# EAGLE board Data_memory (EAGLE 9.4.2), part 1 of 2
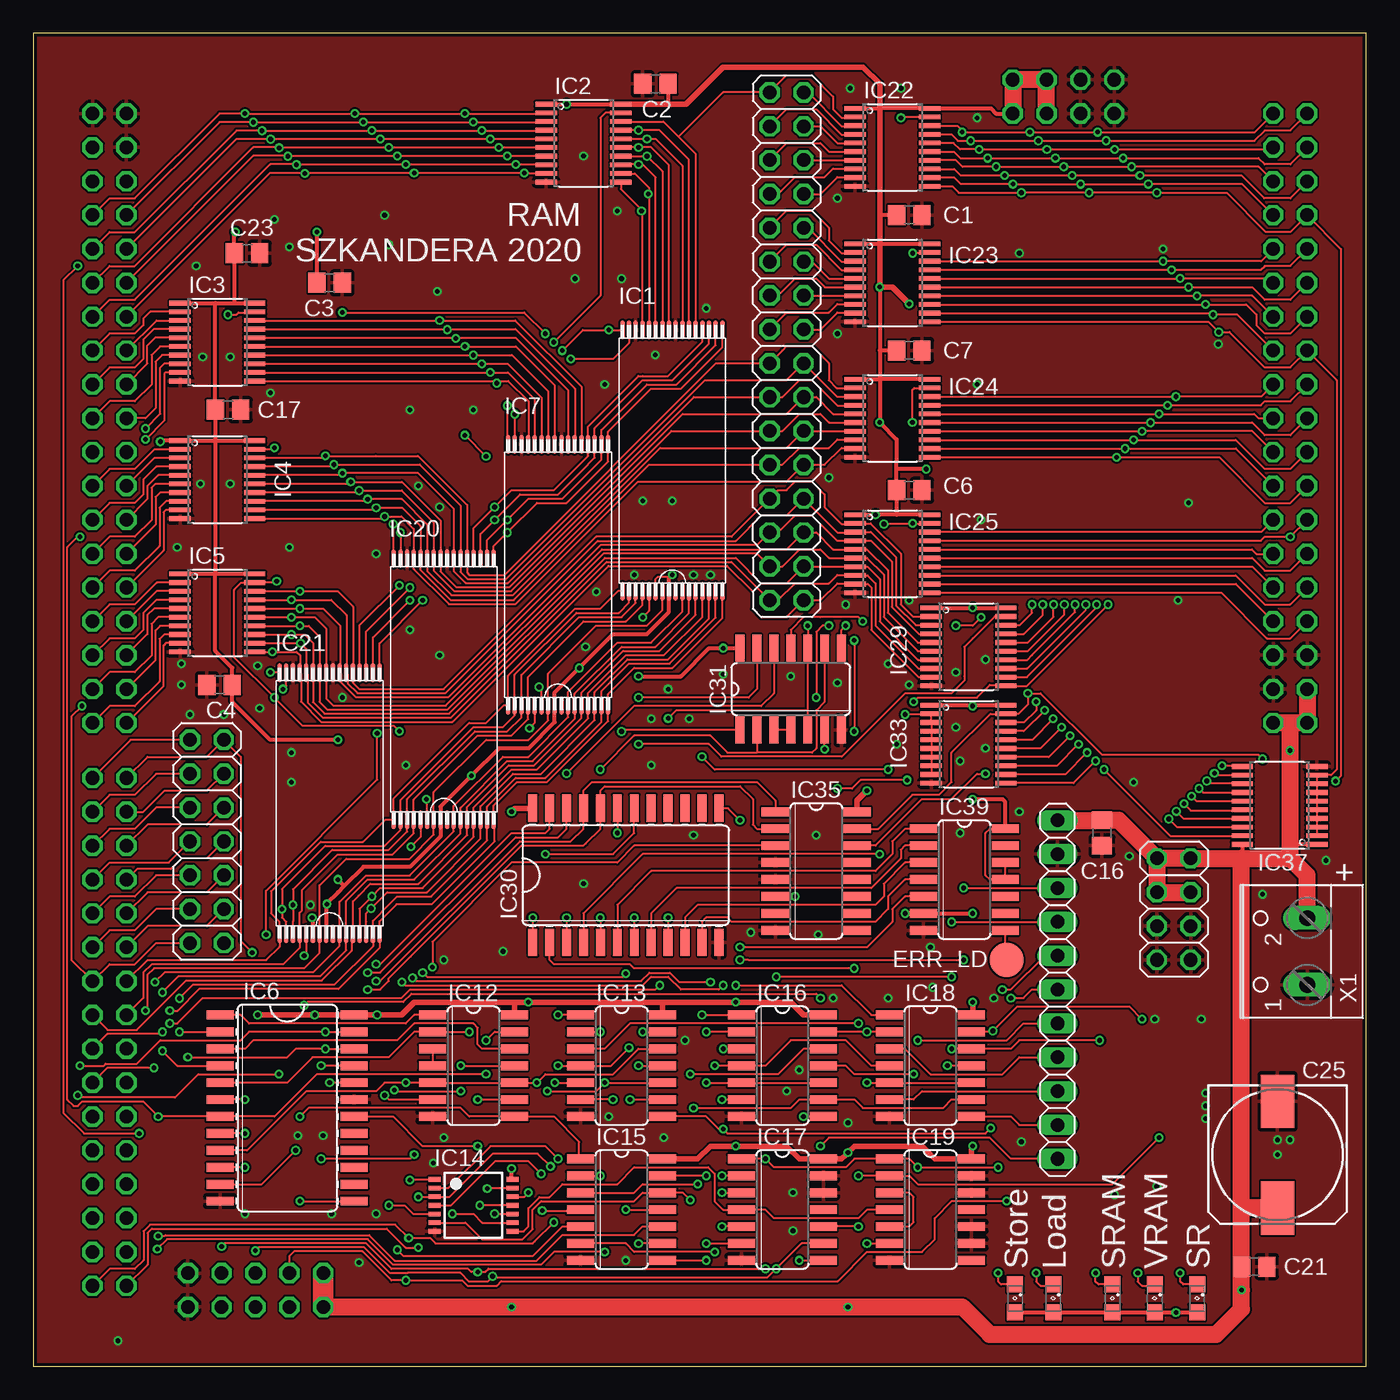
[diagram p2: board, top side]
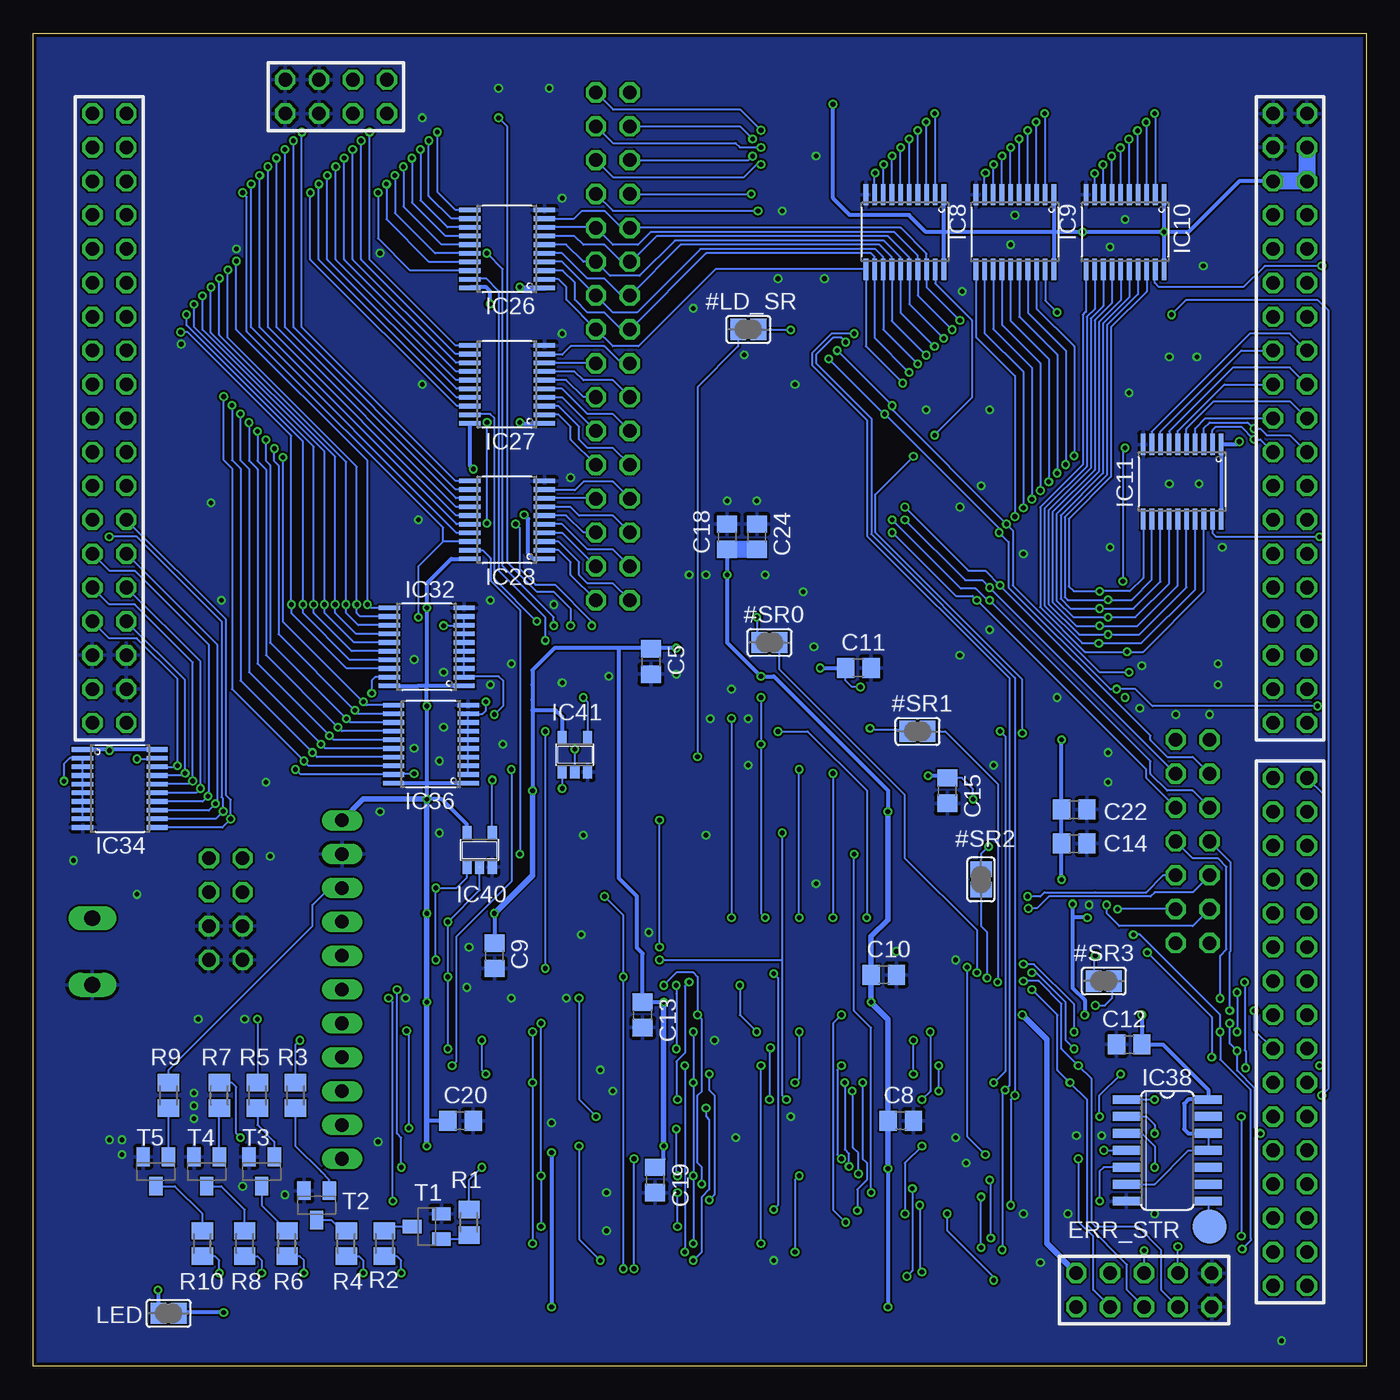
[diagram p3: board, bottom side, seen from below]

Size 100 x 100 mm. Coordinates in mm from the lower left corner, seen from the top.
Outline: 0,0 100,0 100,100 0,100 0,0
Copper layers (1*16): Top 0.035mm / dielectric 1.5mm / Bottom 0.035mm
Design rules "SeeedStudio_2layer_DRU_no_angle_20140221": minimum track width 6mil, minimum drill 12mil, track to track 6mil, track to pad 6mil, pad to pad 6mil, via to via 6mil, smd to smd 0mil, copper to edge 10mil, drill to drill 10mil, minimum pad ring 10mil, minimum via ring 6mil, stop-mask expansion 2mil, vias tented up to drill 100mil, thermal gap 10mil

## Footprints (pad centres in the part's own frame; a part is rotated, then mirrored left to right if it is on the bottom)
SJ = smd 1.168 x 1.6: 1 -0.762,0; 2 0.762,0
2X16 = drill 1.016 octagon: 1 -19.05,-1.27; 2 -19.05,1.27; 3 -16.51,-1.27; 4 -16.51,1.27; 5 -13.97,-1.27; 6 -13.97,1.27; 7 -11.43,-1.27; 8 -11.43,1.27; 9 -8.89,-1.27; 10 -8.89,1.27; 11 -6.35,-1.27; 12 -6.35,1.27; 13 -3.81,-1.27; 14 -3.81,1.27; 15 -1.27,-1.27; 16 -1.27,1.27; 17 1.27,-1.27; 18 1.27,1.27; 19 3.81,-1.27; 20 3.81,1.27; 21 6.35,-1.27; 22 6.35,1.27; 23 8.89,-1.27; 24 8.89,1.27; 25 11.43,-1.27; 26 11.43,1.27; 27 13.97,-1.27; 28 13.97,1.27; 29 16.51,-1.27; 30 16.51,1.27; 31 19.05,-1.27; 32 19.05,1.27
C0805 = smd 1.3 x 1.5: 1 -0.95,0; 2 0.95,0
153CLV-1010 = smd 4 x 2.5: + 4,0; - -4,0
B2,54 = smd 2.54 x 2.54: TP 0,0
TSOP-I-32-8X20MM = smd 1.4 x 0.33: 1 -9.8,3.75; 2 -9.8,3.25; 3 -9.8,2.75; 4 -9.8,2.25; 5 -9.8,1.75; 6 -9.8,1.25; 7 -9.8,0.75; 8 -9.8,0.25; 9 -9.8,-0.25; 10 -9.8,-0.75; 11 -9.8,-1.25; 12 -9.8,-1.75; 13 -9.8,-2.25; 14 -9.8,-2.75; 15 -9.8,-3.25; 16 -9.8,-3.75; 17 9.8,-3.75; 18 9.8,-3.25; 19 9.8,-2.75; 20 9.8,-2.25; 21 9.8,-1.75; 22 9.8,-1.25; 23 9.8,-0.75; 24 9.8,-0.25; 25 9.8,0.25; 26 9.8,0.75; 27 9.8,1.25; 28 9.8,1.75; 29 9.8,2.25; 30 9.8,2.75; 31 9.8,3.25; 32 9.8,3.75
TSSOP20 = smd 0.35 x 1.6: 1 -2.925,-2.8; 2 -2.275,-2.8; 3 -1.625,-2.8; 4 -0.975,-2.8; 5 -0.325,-2.8; 6 0.325,-2.8; 7 0.975,-2.8; 8 1.625,-2.8; 9 2.275,-2.8; 10 2.925,-2.8; 11 2.925,2.8; 12 2.275,2.8; 13 1.625,2.8; 14 0.975,2.8; 15 0.325,2.8; 16 -0.325,2.8; 17 -0.975,2.8; 18 -1.625,2.8; 19 -2.275,2.8; 20 -2.925,2.8
SO24W = smd 0.66 x 2.032: 1 -6.985,-5.029; 2 -5.715,-5.029; 3 -4.445,-5.029; 4 -3.175,-5.029; 5 -1.905,-5.029; 6 -0.635,-5.029; 7 0.635,-5.029; 8 1.905,-5.029; 9 3.175,-5.029; 10 4.445,-5.029; 11 5.715,-5.029; 12 6.985,-5.029; 13 6.985,5.029; 14 5.715,5.029; 15 4.445,5.029; 16 3.175,5.029; 17 1.905,5.029; 18 0.635,5.029; 19 -0.635,5.029; 20 -1.905,5.029; 21 -3.175,5.029; 22 -4.445,5.029; 23 -5.715,5.029; 24 -6.985,5.029
SO14 = smd 0.66 x 2.032: 1 -3.81,-3.073; 2 -2.54,-3.073; 3 -1.27,-3.073; 4 0,-3.073; 5 1.27,-3.073; 6 2.54,-3.073; 7 3.81,-3.073; 8 3.81,3.073; 9 2.54,3.073; 10 1.27,3.073; 11 0,3.073; 12 -1.27,3.073; 13 -2.54,3.073; 14 -3.81,3.073
TSSOP14 = smd 0.35 x 0.9: 1 -1.95,-2.925; 2 -1.3,-2.925; 3 -0.65,-2.925; 4 0,-2.925; 5 0.65,-2.925; 6 1.3,-2.925; 7 1.95,-2.925; 8 1.95,2.925; 9 1.3,2.925; 10 0.65,2.925; 11 0,2.925; 12 -0.65,2.925; 13 -1.3,2.925; 14 -1.95,2.925
SO16 = smd 0.66 x 2.032: 1 -4.445,-3.073; 2 -3.175,-3.073; 3 -1.905,-3.073; 4 -0.635,-3.073; 5 0.635,-3.073; 6 1.905,-3.073; 7 3.175,-3.073; 8 4.445,-3.073; 9 4.445,3.073; 10 3.175,3.073; 11 1.905,3.073; 12 0.635,3.073; 13 -0.635,3.073; 14 -1.905,3.073; 15 -3.175,3.073; 16 -4.445,3.073
SOT23-5 = smd 0.69 x 0.99: 1 -0.95,-1.29; 2 0,-1.29; 3 0.95,-1.29; 4 0.95,1.3; 5 -0.95,1.3
1X11 = drill 1.016 long: 1 -12.7,0; 2 -10.16,0; 3 -7.62,0; 4 -5.08,0; 5 -2.54,0; 6 0,0; 7 2.54,0; 8 5.08,0; 9 7.62,0; 10 10.16,0; 11 12.7,0
SML0805 = smd 1.2 x 1.2: A 1.05,0; C -1.05,0
2X04 = drill 1.016 octagon: 1 -3.81,-1.27; 2 -3.81,1.27; 3 -1.27,-1.27; 4 -1.27,1.27; 5 1.27,-1.27; 6 1.27,1.27; 7 3.81,-1.27; 8 3.81,1.27
M0805 = smd 1.3 x 1.6: 1 -0.95,0; 2 0.95,0
2X19 = drill 1.016 octagon: 1 -22.86,-1.27; 2 -22.86,1.27; 3 -20.32,-1.27; 4 -20.32,1.27; 5 -17.78,-1.27; 6 -17.78,1.27; 7 -15.24,-1.27; 8 -15.24,1.27; 9 -12.7,-1.27; 10 -12.7,1.27; 11 -10.16,-1.27; 12 -10.16,1.27; 13 -7.62,-1.27; 14 -7.62,1.27; 15 -5.08,-1.27; 16 -5.08,1.27; 17 -2.54,-1.27; 18 -2.54,1.27; 19 0,-1.27; 20 0,1.27; 21 2.54,-1.27; 22 2.54,1.27; 23 5.08,-1.27; 24 5.08,1.27; 25 7.62,-1.27; 26 7.62,1.27; 27 10.16,-1.27; 28 10.16,1.27; 29 12.7,-1.27; 30 12.7,1.27; 31 15.24,-1.27; 32 15.24,1.27; 33 17.78,-1.27; 34 17.78,1.27; 35 20.32,-1.27; 36 20.32,1.27; 37 22.86,-1.27; 38 22.86,1.27
2X07 = drill 1.016 octagon: 1 -7.62,-1.27; 2 -7.62,1.27; 3 -5.08,-1.27; 4 -5.08,1.27; 5 -2.54,-1.27; 6 -2.54,1.27; 7 0,-1.27; 8 0,1.27; 9 2.54,-1.27; 10 2.54,1.27; 11 5.08,-1.27; 12 5.08,1.27; 13 7.62,-1.27; 14 7.62,1.27
2X05 = drill 1.016 octagon: 1 -5.08,-1.27; 2 -5.08,1.27; 3 -2.54,-1.27; 4 -2.54,1.27; 5 0,-1.27; 6 0,1.27; 7 2.54,-1.27; 8 2.54,1.27; 9 5.08,-1.27; 10 5.08,1.27
SOT23-BEC = smd 1 x 1.4: B -0.95,-1.1; C 0,1.1; E 0.95,-1.1
W237-102 = drill 1.194 long: 1 -2.5,-1.27; 2 2.5,-1.27

## Placement (x,y rotation side)
#LD_SR  [SJ]  46.35,77.79 0 bottom
#SR0  [SJ]  44.77,54.29 0 bottom
#SR1  [SJ]  33.66,47.62 0 bottom
#SR2  [SJ]  28.89,36.51 90 bottom
#SR3  [SJ]  19.68,28.89 0 bottom
ALU_O_C0  [2X16]  5.71,25.08 270 top
C1  [C0805]  65.72,86.36 0 top
C2  [C0805]  46.67,96.2 180 top
C3  [C0805]  22.23,81.28 0 top
C4  [C0805]  13.97,51.12 180 top
C5  [C0805]  53.66,52.86 270 bottom
C6  [C0805]  65.72,65.72 0 top
C7  [C0805]  65.72,76.2 0 top
C8  [C0805]  34.92,18.41 0 bottom
C9  [C0805]  65.41,30.8 270 bottom
C10  [C0805]  36.2,29.37 0 bottom
C11  [C0805]  38.1,52.39 0 bottom
C12  [C0805]  17.78,24.13 180 bottom
C13  [C0805]  54.29,26.35 270 bottom
C14  [C0805]  21.91,39.21 0 bottom
C15  [C0805]  31.43,43.18 270 bottom
C16  [C0805]  80.17,40.01 270 top
C17  [C0805]  14.61,71.75 0 top
C18  [C0805]  47.94,62.23 90 bottom
C19  [C0805]  53.34,13.97 270 bottom
C20  [C0805]  67.94,18.41 0 bottom
C21  1u  [C0805]  91.6,7.46 0 top
C22  1u  [C0805]  21.91,41.75 0 bottom
C23  1u  [C0805]  16.03,83.5 0 top
C24  1u  [C0805]  45.72,62.23 90 bottom
C25  [153CLV-1010]  93.34,15.88 270 top
ERR_LD  PTR1B2,54  [B2,54]  73.03,30.48 0 top
ERR_STR  PTR1B2,54  [B2,54]  11.75,10.48 0 bottom
IC1  IS65C1024AL-45T  [TSOP-I-32-8X20MM]  47.94,67.94 90 top
IC2  74245  [TSSOP20]  41.27,91.76 270 top
IC3  74245  [TSSOP20]  13.81,76.83 270 top
IC4  74245  [TSSOP20]  13.81,66.52 270 top
IC5  74245  [TSSOP20]  13.81,56.52 270 top
IC6  74HCT154DW  [SO24W]  19.05,19.37 270 top
IC7  IS65C1024AL-45T  [TSOP-I-32-8X20MM]  39.37,59.37 90 top
IC8  74245  [TSSOP20]  34.61,85.09 180 bottom
IC9  74245  [TSSOP20]  26.35,85.09 180 bottom
IC10  74245  [TSSOP20]  18.1,85.09 180 bottom
IC11  74245  [TSSOP20]  13.81,66.36 180 bottom
IC12  74AC08D  [SO14]  33.02,22.54 270 top
IC13  74AC08D  [SO14]  44.13,22.54 270 top
IC14  7404  [TSSOP14]  33.02,12.06 270 top
IC15  74AC00D  [SO14]  44.13,11.75 270 top
IC16  74AC00D  [SO14]  56.2,22.54 270 top
IC17  74AC08D  [SO14]  56.2,11.75 270 top
IC18  74AC00D  [SO14]  67.31,22.54 270 top
IC19  74AC08D  [SO14]  67.31,11.75 270 top
IC20  IS65C1024AL-45T  [TSOP-I-32-8X20MM]  30.8,50.8 90 top
IC21  IS65C1024AL-45T  [TSOP-I-32-8X20MM]  22.23,42.23 90 top
IC22  74245  [TSSOP20]  64.45,91.44 270 top
IC23  74245  [TSSOP20]  64.45,81.28 270 top
IC24  74245  [TSSOP20]  64.45,71.12 270 top
IC25  74245  [TSSOP20]  64.45,60.96 270 top
IC26  74245  [TSSOP20]  64.45,83.82 90 bottom
IC27  74245  [TSSOP20]  64.45,73.66 90 bottom
IC28  74245  [TSSOP20]  64.45,63.5 90 bottom
IC29  74245  [TSSOP20]  70.17,53.98 270 top
IC30  74HCT154DW  [SO24W]  44.45,36.83 0 top
IC31  74AC08D  [SO14]  56.83,50.8 0 top
IC32  74245  [TSSOP20]  70.48,53.98 90 bottom
IC33  74245  [TSSOP20]  70.17,46.67 270 top
IC34  74245  [TSSOP20]  93.5,43.34 270 bottom
IC35  74AC138D  [SO16]  58.74,37.15 270 top
IC36  74245  [TSSOP20]  70.17,46.67 90 bottom
IC37  74245  [TSSOP20]  93.5,42.07 90 top
IC38  74AC30D  [SO14]  14.92,16.19 270 bottom
IC39  74AC30D  [SO14]  69.85,36.51 270 top
IC40  74HCT1G00  [SOT23-5]  66.52,38.73 0 bottom
IC41  74HCT1G08  [SOT23-5]  59.37,45.88 0 bottom
JP4  [1X11]  76.83,28.26 90 top
LED  [SJ]  89.85,3.97 0 bottom
LED1  [SML0805]  73.66,5.08 270 top
LED2  [SML0805]  80.96,5.08 270 top
LED3  [SML0805]  84.14,5.08 270 top
LED4  [SML0805]  87.31,5.08 270 top
LED8  [SML0805]  76.52,5.08 270 top
MB_C0  [2X16]  56.52,76.52 270 top
PWR  [2X04]  85.57,34.29 270 top
PWR1  [2X04]  77.29,95.25 0 top
R1  10k  [M0805]  67.31,10.79 270 bottom
R2  10k  [M0805]  73.66,9.21 270 bottom
R3  10k  [M0805]  80.33,20.32 270 bottom
R4  10k  [M0805]  76.52,9.21 270 bottom
R5  10k  [M0805]  83.19,20.32 270 bottom
R6  10k  [M0805]  80.96,9.21 270 bottom
R7  10k  [M0805]  86.04,20.32 270 bottom
R8  10k  [M0805]  84.14,9.21 270 bottom
R9  10k  [M0805]  89.85,20.32 270 bottom
R10  10k  [M0805]  87.31,9.21 270 bottom
RAM_O_C0  [2X19]  94.3,71.12 270 top
RB1_C0  [2X19]  5.71,71.12 270 top
RS2_C0  [2X07]  13.02,39.37 270 top
SIGNALS_C0  [2X05]  16.67,5.71 0 top
T1  [SOT23-BEC]  70.48,10.48 90 bottom
T2  [SOT23-BEC]  78.74,12.06 180 bottom
T3  [SOT23-BEC]  82.87,14.61 180 bottom
T4  [SOT23-BEC]  87,14.61 180 bottom
T5  [SOT23-BEC]  90.81,14.61 180 bottom
X1  [W237-102]  94.3,31.11 90 top

## Tracks (layer width: path | path; a pad name or v marks a point on that pad's centre or on a via)
#CLK
  Top 0.152: IC19.4 62.55,11.75 61.91,11.11 55.56,11.11 54.93,11.75 IC17.4 51.75,11.75 51.12,12.38 51.12,14.44 50.63,14.92 45.09,14.92 43.81,13.65 39.69,13.65 38.72,12.69 37.97,12.69 37.15,11.86 37.15,10.48 36.78,10.12 IC14.8
#LOAD  (via drill 0.35)
  Top 0.152: IC14.12 36.84,12.71 v37.15,13.02 | v38.42,38.42 43.5,38.42 45.09,40.01 IC30.18
  Bottom 0.152: v38.42,38.42 38.42,26.67 37.15,25.4 v37.15,13.02
#LOAD_SRAM  (via drill 0.35)
  Top 0.152: v39.69,76.2 41.23,77.75 v43.18,77.75 IC1.32 | v17.78,52.07 18.43,52.07 IC21.32 | IC18.11 v68.58,22.54 | v50.16,45.72 51.12,44.77 v64.14,44.77 | IC20.32 26.99,60.66 v26.99,63.18 | IC7.32 35.56,69.23 v35.56,72.07
  Bottom 0.152: v39.69,76.2 v35.56,72.07 35.56,71.75 v26.99,63.18 26.51,62.71 26.51,58.58 20,52.07 v17.78,52.07 | v68.58,22.54 68.26,22.86 68.26,32.23 64.14,36.35 v64.14,44.77 | v43.18,77.75 43.22,77.79 #LD_SR.2 #LD_SR.1 47.12,76.52 50.16,73.47 v50.16,45.72
#STORE_R0  (via drill 0.35)
  Top 0.152: IC1.5 46.19,56.67 v45.72,56.2 | v29.21,29.53 29.53,29.21 44.21,29.21 v44.45,29.45 | v44.45,11.75 IC15.11
  Bottom 0.152: v29.21,29.53 29.18,29.55 29.18,32.68 34.61,38.1 34.61,42.86 44.01,52.26 #SR0.2 #SR0.1 45.69,54.45 45.69,56.17 v45.72,56.2 | v44.45,29.45 44.13,29.13 44.13,12.06 v44.45,11.75
#STORE_R1  (via drill 0.35)
  Top 0.152: IC7.5 37.62,48.26 v37.22,47.87 | v27.64,28.81 27.88,28.57 45.72,28.57 46.35,29.21 47.62,29.21 48.58,28.26 51.44,28.26 v51.75,28.57 | v51.75,23.81 IC16.3
  Bottom 0.152: v27.64,28.81 27.62,28.83 27.62,43.66 31.58,47.62 #SR1.2 #SR1.1 34.58,47.78 37.14,47.78 v37.22,47.87 | v51.75,28.57 51.75,27.94 v51.75,23.81
#STORE_R2  (via drill 0.35)
  Top 0.152: IC20.5 29.05,39.69 v28.33,38.98 | v28.45,29.13 28.69,28.89 45.61,28.89 46.23,29.52 47.75,29.52 48.45,28.81 v50.8,28.81 | v51.67,20 IC16.6
  Bottom 0.152: v50.8,28.81 51.12,28.5 51.12,23.5 51.75,22.86 51.75,20.08 v51.67,20 | v28.33,38.98 28.89,38.42 #SR2.2 #SR2.1 28.89,33.02 28.45,32.58 v28.45,29.13
#STORE_R3  (via drill 0.35)
  Top 0.152: IC21.5 20.48,30.95 v20.32,30.8 | v20.32,27.07 20.57,27.32 27.75,27.32 28.37,27.94 58.74,27.94 v59.05,27.62 | v57.78,18.73 IC16.8
  Bottom 0.152: v59.05,27.62 59.05,20 v57.78,18.73 | v20.32,30.8 20.45,30.67 #SR3.1 19.05,28.89 | 19.05,28.89 #SR3.2 | v20.32,27.07 19.61,27.07 19.05,27.62 19.05,28.89
#STORE_VR0  (via drill 0.35)
  Top 0.152: v66.04,21.91 61.59,21.91 60.96,22.54 IC16.11 | JP4.5 74.3,25.72 73.03,24.45 v66.36,24.45
  Bottom 0.152: v66.36,24.45 66.36,22.23 v66.04,21.91
#STORE_VR1
  Top 0.152: IC18.3 65.41,23.81 67.31,21.91 72.71,21.91 73.98,23.18 JP4.4
#STORE_VR2
  Top 0.152: IC18.6 66.04,20 66.67,20.64 JP4.3
#STORE_VR3
  Top 0.152: IC18.8 73.34,18.73 73.98,18.1 JP4.2
#STR  (via drill 0.35)
  Top 0.152: IC6.18 26.99,18.73 29.21,16.51 v33.34,16.51 | v34.61,11.43 35.93,11.43 IC14.10
  Bottom 0.152: v33.34,16.51 34.61,15.24 v34.61,11.43
#Y30  (via drill 0.35)
  Top 0.152: IC14.2 31.14,13.37 34.29,16.51 38.42,16.51 v39.37,15.56 | v39.37,22.54 IC13.4 43.35,22.54 v44.69,23.89 | v44.77,20 IC13.9
  Bottom 0.152: v39.37,15.56 39.69,15.88 39.69,22.23 v39.37,22.54 | v44.69,23.89 44.77,23.81 v44.77,20
#Y31  (via drill 0.35)
  Top 0.152: IC13.2 v42.55,25.08 | IC13.10 v42.86,21.27 42.23,20.64 v38.56,20.64 | IC14.4 31.34,12.06 34.66,15.38 37.15,15.38 v38.1,14.43
  Bottom 0.152: v42.55,25.08 42.55,21.59 v42.86,21.27 | v38.1,14.43 38.1,15.99 38.49,16.38 38.49,20.57 v38.56,20.64
_G8  (via drill 0.35)
  Top 0.152: v59.37,46.29 IC31.6
  Bottom 0.152: IC41.2 v59.37,46.29
ALU_O_0  (via drill 0.35)
  Top 0.152: IC6.23 v21.91,25.08 16.19,25.08 15.56,24.45 9.53,24.45 7.77,22.69 5.43,22.69 5.28,22.54 v3.49,22.54 | v25.72,30.16 26.04,30.16 35.88,40.01 38.42,40.01 38.73,40.32 IC30.23 | ALU_O_C0.1 7.3,46.99 RS2_C0.1
  Bottom 0.152: v21.91,25.08 21.91,27.15 24.92,30.16 v25.72,30.16 | ALU_O_C0.1 3.16,42.85 3.16,22.87 v3.49,22.54
ALU_O_1  (via drill 0.35)
  Top 0.152: IC6.22 v21.91,23.81 19.68,23.81 19.05,23.18 v11.59,23.18 | v25.08,29.53 26.04,29.53 36.2,39.69 39.37,39.69 40.01,40.32 IC30.22 | ALU_O_C0.2 8.57,45.72 13.02,45.72 RS2_C0.2 15.56,45.72 15.56,31.9 v16.42,31.04
  Bottom 0.152: v21.91,23.81 22.54,24.45 22.54,27.3 24.77,29.53 v25.08,29.53 | v16.42,31.04 11.59,26.2 v11.59,23.18
ALU_O_2  (via drill 0.35)
  Top 0.152: IC1.20 50.19,76.86 47.62,74.3 45.72,74.3 45.4,74.3 41.62,70.51 IC7.20 41.62,68.29 39.05,65.72 35.88,65.72 v34.61,64.45 33.05,62.89 IC20.20 | v27.46,58.58 24.48,55.59 IC21.20 | ALU_O_C0.3 5.71,42.86 7.62,42.86 9.21,44.45 RS2_C0.3
  Bottom 0.152: v34.61,64.45 29.84,59.69 28.57,59.69 v27.46,58.58 16.19,47.31 16.19,46.99 14.92,45.72 13.02,45.72 RS2_C0.3
ALU_O_3  (via drill 0.35)
  Top 0.152: IC1.19 50.69,76.73 47.94,73.98 45.72,73.98 42.12,70.38 IC7.19 42.12,68.16 41.12,67.15 39.37,65.41 36.51,65.41 v34.61,63.5 33.55,62.44 IC20.19 | IC21.19 24.98,55.14 v28.26,58.42 | RS2_C0.4 13.02,43.18 9.84,43.18 8.26,41.59 ALU_O_C0.4
  Bottom 0.152: v34.61,63.5 30.07,58.96 28.8,58.96 v28.26,58.42 RS2_C0.4
ALU_O_4  (via drill 0.35)
  Top 0.152: IC1.18 51.19,76.59 48.26,73.66 46.04,73.66 42.62,70.24 IC7.18 42.62,68.02 39.69,65.09 37.15,65.09 v35.56,63.5 34.05,61.99 IC20.18 | IC21.18 25.48,54.69 v28.26,57.47 | ALU_O_C0.5 5.71,40.32 7.62,40.32 9.21,41.91 RS2_C0.5
  Bottom 0.152: v35.56,63.5 30.4,58.34 29.3,58.34 28.42,57.47 v28.26,57.47 16.19,45.4 16.19,44.45 14.92,43.18 13.02,43.18 RS2_C0.5
ALU_O_5  (via drill 0.35)
  Top 0.152: IC7.17 43.12,69.22 | 43.12,69.22 43.12,70.11 46.35,73.34 48.58,73.34 51.69,76.46 IC1.17 | IC20.17 34.55,60.64 34.55,61.53 v35.56,62.55 37.78,64.77 40.01,64.77 43.12,67.89 43.12,69.22 | IC21.17 25.98,54.23 v29.21,57.47 | RS2_C0.6 13.02,40.64 8.57,40.64 ALU_O_C0.6
  Bottom 0.152: v35.56,62.55 30.8,57.78 29.53,57.78 v29.21,57.47 16.51,44.77 16.51,44.13 RS2_C0.6
ALU_O_6  (via drill 0.35)
  Top 0.152: IC1.16 51.69,56.14 47.94,52.39 45.09,52.39 43.12,50.42 IC7.16 43.12,48.4 38.53,43.81 36.31,43.81 34.55,42.05 IC20.16 34.61,40.94 34.61,39.37 29.89,34.65 27.25,34.65 25.98,33.38 IC21.16 25.98,31.37 22.9,28.3 12.44,28.3 10.82,26.67 v10.24,26.67 | ALU_O_C0.7 5.71,37.78 10.16,37.78 RS2_C0.7
  Bottom 0.152: v10.24,26.67 10.24,31.08 10.17,31.15 10.17,37.8 RS2_C0.7
ALU_O_7  (via drill 0.35)
  Top 0.152: IC1.15 51.19,56.16 47.74,52.7 44.68,52.7 42.62,50.65 IC7.15 42.62,48.34 38.42,44.13 36.2,44.13 34.05,41.98 IC20.15 34.05,39.45 29.84,35.24 27.3,35.24 26.67,34.61 25.48,33.41 IC21.15 25.48,31.51 22.58,28.61 11.97,28.61 v10.95,27.59 | RS2_C0.8 13.02,38.1 11.11,38.1 10.32,37.31 7.78,37.31 ALU_O_C0.8
  Bottom 0.152: v10.95,27.59 10.95,30.8 10.48,31.27 10.48,37.47 11.11,38.1 13.02,38.1 RS2_C0.8
ALU_O_8  (via drill 0.35)
  Top 0.152: IC21.14 24.98,33.34 24.98,33.98 v25.34,34.35 25.5,34.51 26.56,35.56 29.53,35.56 33.55,39.58 IC20.14 33.55,42.01 35.99,44.45 38.1,44.45 42.12,48.47 IC7.14 42.12,50.58 44.56,53.02 47.62,53.02 50.69,56.09 IC1.14 | ALU_O_C0.9 5.71,35.24 7.62,35.24 9.21,36.83 RS2_C0.9
  Bottom 0.152: RS2_C0.9 13.02,35.56 15.88,35.56 16.19,35.24 23.81,35.24 24.61,34.45 24.71,34.35 v25.34,34.35
ALU_O_9  (via drill 0.35)
  Top 0.152: IC21.13 24.48,34.32 v25.4,35.24 26.04,35.88 29.21,35.88 33.05,39.72 IC20.13 33.05,41.94 35.88,44.77 37.78,44.77 41.62,48.6 IC7.13 41.62,50.51 44.45,53.34 47.31,53.34 50.19,56.23 IC1.13 | RS2_C0.10 13.02,35.56 8.57,35.56 ALU_O_C0.10
  Bottom 0.152: RS2_C0.10 15.24,36.83 16.51,35.56 20.32,35.56 24.13,35.56 24.45,35.24 v25.4,35.24
ALU_O_10  (via drill 0.35)
  Top 0.152: IC21.3 19.48,33.38 v19.48,34.61 19.48,35.78 22.43,38.73 26.67,38.73 28.05,40.11 IC20.3 28.05,42.54 33.13,47.62 35.56,47.62 36.62,48.69 IC7.3 36.62,51.86 40.96,56.2 44.13,56.2 45.19,57.26 IC1.3 | ALU_O_C0.11 5.71,32.7 7.62,32.7 9.21,34.29 RS2_C0.11
  Bottom 0.152: RS2_C0.11 13.02,33.02 18.52,33.02 19.48,33.97 v19.48,34.61
ALU_O_11  (via drill 0.35)
  Top 0.152: IC21.2 18.98,33.34 18.66,33.66 v18.66,34.29 18.66,35.8 21.89,39.04 26.34,39.04 27.55,40.25 IC20.2 27.55,42.47 33.02,47.94 35.24,47.94 36.12,48.82 IC7.2 36.12,51.88 40.75,56.52 43.93,56.52 44.69,57.28 IC1.2 | RS2_C0.12 13.02,33.02 8.57,33.02 ALU_O_C0.12
  Bottom 0.152: RS2_C0.12 v18.66,34.29
ALU_O_12  (via drill 0.35)
  Top 0.152: IC1.31 44.69,76.76 43.5,75.56 v40.32,75.56 | v36.12,71.44 IC7.31 | v18.73,50.8 18.98,51.04 IC21.31 | v27.54,62.55 v27.55,62.54 IC20.31 | v3.65,49.53 2.86,48.74 2.86,30.48 ALU_O_C0.13 5.71,30.16 7.62,30.16 9.21,31.75 RS2_C0.13
  Bottom 0.152: v40.32,75.56 36.2,71.44 v36.12,71.44 27.54,62.87 v27.54,62.55 26.83,61.83 26.83,58.42 19.21,50.8 v18.73,50.8 17.3,50.8 16.03,49.53 v3.65,49.53
ALU_O_13
  Top 0.152: IC1.1 43.86,58.15 42.55,56.83 40.64,56.83 35.62,51.81 IC7.1 35.28,49.57 33.97,48.26 32.7,48.26 27.05,42.6 IC20.1 26.39,41 24.74,39.34 21.57,39.34 17.84,35.62 17.84,33.97 18.48,33.34 IC21.1 18.48,31.48 17.48,30.48 8.57,30.48 ALU_O_C0.14
ALU_O_14
  Top 0.152: IC1.12 49.69,56.36 46.99,53.66 44.25,53.66 41.12,50.53 IC7.12 41.12,48.63 37.58,45.09 35.67,45.09 32.55,41.96 IC20.12 32.55,39.85 28.89,36.2 25.29,36.2 24.39,35.3 23.98,34.88 IC21.12 23.87,32.32 23.87,31.16 21.65,28.94 11.48,28.94 7.77,25.23 5.57,25.23 ALU_O_C0.15
ALU_O_15
  Top 0.152: IC1.4 45.69,57.12 44.45,55.88 41.27,55.88 37.12,51.73 IC7.4 37.12,48.55 35.88,47.31 33.34,47.31 28.55,42.52 IC20.4 28.55,39.98 26.95,38.38 22.82,38.38 20.13,35.69 20.13,34.17 19.98,34.02 IC21.4 20,32.4 20,31.43 18.73,30.16 8.89,30.16 8.26,29.53 8.26,27.62 ALU_O_C0.16
ALU_O_16  (via drill 0.35)
  Top 0.152: IC1.11 49.19,56.49 46.67,53.98 44.13,53.98 40.62,50.46 IC7.11 40.64,49.55 40.64,48.58 37.47,45.4 35.56,45.4 32.05,41.89 IC20.11 32.05,39.98 28.57,36.51 25.08,36.51 23.48,34.91 IC21.11 23.48,31.2 21.52,29.25 10.89,29.25 v9.68,28.04 | v9.68,25.08 9.53,24.92 5.56,24.92 ALU_O_C0.17
  Bottom 0.152: v9.68,28.04 v9.68,25.08
ALU_O_17  (via drill 0.35)
  Top 0.152: IC1.7 47.19,56.72 46.04,55.56 42.23,55.56 38.62,51.95 IC7.7 38.62,48.46 37.15,46.99 33.97,46.99 30.05,43.06 IC20.7 30.05,39.89 28.23,38.08 23.47,38.08 21.48,36.08 IC21.7 21.48,31 20.33,29.86 9.06,29.86 8.56,29.36 8.56,26.82 v8.41,26.67
  Bottom 0.152: v8.41,26.67 8.41,25.24 ALU_O_C0.18
ALU_O_18  (via drill 0.35)
  Top 0.152: IC1.10 48.69,56.63 46.35,54.29 43.81,54.29 40.12,50.6 IC7.10 40.12,48.69 37.15,45.72 35.24,45.72 31.55,42.02 IC20.10 31.55,40.12 28.25,36.82 24.96,36.82 22.98,34.84 IC21.10 22.98,31.52 21.01,29.55 9.86,29.55 v9.12,28.81 | v9.05,22.38 5.56,22.38 ALU_O_C0.19
  Bottom 0.152: v9.12,28.81 9.12,23.73 9.05,23.65 v9.05,22.38
ALU_O_30  (via drill 0.35)
  Top 0.152: v28.26,13.97 28.3,14.02 IC14.1 | IC13.1 v39.37,26.35 | v39.05,10.79 37.62,9.37 | 37.62,9.37 37.47,9.21 | 37.47,9.21 30.16,9.21 29.75,9.62 v28.16,9.62 27.16,10.62 8.76,10.62 8.27,10.13 8.27,7.95 7.62,7.3 5.71,7.3 ALU_O_C0.31 | 37.47,9.21 37.62,9.37
  Bottom 0.152: v28.16,9.62 28.16,13.88 v28.26,13.97 | v39.37,26.35 40.01,25.72 40.01,11.75 v39.05,10.79
ALU_O_31  (via drill 0.35)
  Top 0.152: v28.89,12.7 28.91,12.71 IC14.3 31.24,12.71 34.47,15.94 37.85,15.94 v38.8,14.99 | v39.13,21.27 IC13.5 | ALU_O_C0.32 8.57,7.62 8.57,10 8.89,10.32 26.51,10.32 27.94,8.89 v28.89,8.89
  Bottom 0.152: v28.89,8.89 v28.89,12.7 | v38.8,14.99 38.8,15.94 39.12,16.26 39.12,21.26 v39.13,21.27
B  (via drill 0.35)
  Top 0.152: v92.23,45.56 91.92,45.88 80.17,45.88 75.56,50.48 v74.61,50.48 74.61,49.64 73.92,48.95 IC33.19 71.81,48.95 68.9,46.04 68.9,43.81 67.94,42.86 65.94,42.86 63.4,40.32 IC35.15
  Bottom 0.152: IC32.19 74.35,51.7 74.61,51.44 v74.61,50.48 | v92.23,45.56 90.76,45.56 IC34.19
B0
  Top 0.152: IC12.1 28.57,26.35 27.94,25.72 16.19,25.72 15.56,26.35 IC6.1
B1  (via drill 0.35)
  Top 0.152: v32.38,69.85 v33.97,68.26 | IC15.2 v42.55,14.29 | v9.3,8.79 10.03,9.53 25.08,9.53 26.99,7.62 38.1,7.62 39.05,8.57 v42.86,8.57 | v10.95,25.08 IC6.2 | v17.46,32.38 17.46,35.67 25.8,44.01 v25.8,47.49
  Bottom 0.152: IC8.19 32.33,81.23 29.58,78.48 29.58,72.65 v32.38,69.85 | v33.97,68.26 36.83,65.41 36.83,62.55 25.8,51.51 v25.8,47.49 | v42.55,14.29 42.86,13.97 v42.86,8.57 | v9.3,8.79 8.67,9.43 8.67,9.59 8.67,20.73 10.95,23.02 v10.95,25.08 10.95,26.35 16.99,32.38 v17.46,32.38
B2
  Top 0.152: IC12.12 33.66,23.81 33.34,24.13 33.34,25.4 33.02,25.72 28.57,25.72 27.3,24.45 16.51,24.45 15.88,23.81 IC6.3
B3  (via drill 0.35)
  Top 0.152: v46.99,28.57 46.67,28.26 28.26,28.26 27.62,27.62 12.7,27.62 10.79,25.72 v10.24,25.72 | v45.72,25.08 IC13.13 | v3.33,82.55 2.25,81.46 2.25,19.02 3.81,17.46 v7.94,17.46 | v9.68,23.65 10.79,22.54 IC6.4
  Bottom 0.152: IC10.19 15.88,82.24 15.88,81.28 15.56,80.96 9.21,80.96 7.62,82.55 v3.33,82.55 | v46.99,28.57 46.99,26.35 v45.72,25.08 | v7.94,17.46 8.36,17.89 8.36,20.86 9.68,22.18 v9.68,23.65 10.24,24.21 v10.24,25.72
BO0  (via drill 0.35)
  Top 0.152: IC31.1 44.23,47.73 v44.13,47.62 | v37.47,33.66 IC30.1
  Bottom 0.152: v44.13,47.62 41.91,47.62 37.47,43.18 v37.47,33.66
BO1  (via drill 0.35)
  Top 0.152: v61.59,29.84 48.26,29.84 45.09,29.84 44.77,30.16 39.05,30.16 38.73,30.48 IC30.2 | v61.59,54.45 v61.59,47.62
  Bottom 0.152: IC26.19 67.18,81.62 66.04,81.62 65.09,80.66 65.09,59.69 62.87,57.47 61.59,56.2 v61.59,54.45 | v61.59,47.62 v61.59,29.84
BO2  (via drill 0.35)
  Top 0.152: IC31.12 55.56,50.48 54.61,49.53 45.06,49.53 v40.01,44.47 | v40.01,33.66 IC30.3
  Bottom 0.152: v40.01,44.47 v40.01,33.66
BO3  (via drill 0.35)
  Top 0.152: v63.5,38.42 45.72,38.42 41.27,33.97 IC30.4
  Bottom 0.152: IC28.19 66.31,61.23 65.71,60.63 65.71,58.93 63.5,56.72 v63.5,38.42
CLK  (via drill 0.35)
  Top 0.152: v31.43,11.43 33.02,11.43 33.69,10.77 IC14.9 | v73.03,12.38 68.9,12.38 67.63,11.11 67.63,9.53 66.67,8.57 62.55,8.57 60.35,6.38 35.11,6.38 34.78,6.04 32.58,6.04 32.18,6.44 v27.94,6.44 26.87,6.44 24.7,8.61 19.56,8.61 19.21,8.26 SIGNALS_C0.8 | v73.34,27.62 74.3,27.62 74.93,28.26 JP4.6
  Bottom 0.152: v31.43,11.43 31.43,10.16 27.94,6.67 v27.94,6.44 | v73.03,12.38 73.03,27.3 v73.34,27.62
ERR_UN_LOAD
  Top 0.152: ERR_LD.TP 72.92,30.58 IC39.8
ERR_UN_STR
  Bottom 0.152: ERR_STR.TP 11.85,10.58 IC38.8
G1  (via drill 0.35)
  Top 0.152: IC2.19 42.91,94.03 42.55,93.66 42.55,80.33 v39.05,76.83 | v26.35,20.32 26.67,20 IC12.6 | v26.67,12.06 27.86,12.06 28.51,11.41 IC14.5
  Bottom 0.152: v39.05,76.83 39.37,77.15 40.01,77.15 41.27,75.88 41.27,75.25 40.32,74.3 37.13,71.11 37.13,62.42 26.35,51.64 v26.35,20.32 26.67,20 v26.67,12.06
G2  (via drill 0.35)
  Top 0.152: IC3.19 16.56,79.06 15.4,79.06 15.24,78.9 v14.61,78.9 | v20,18.73 20.64,19.37 32.07,19.37 32.7,18.73 IC12.8 39.05,18.73 40.96,16.83 40.96,15.66 IC15.1 | v3.33,20.32 3.49,20.16 10.64,20.16 12.38,21.91 v18.41,21.91
  Bottom 0.152: v20,18.73 20,20.32 v18.41,21.91 | v14.61,78.9 13.49,80.01 3.65,80.01 2.86,79.22 2.86,20.8 v3.33,20.32
G5  (via drill 0.35)
  Top 0.152: v38.42,77.47 36.83,79.06 v23.18,79.06 | v27.1,20.72 27.1,20.64 v32.07,20.64 | v32.07,22.54 IC12.11 | v27.3,8.73 27.78,8.26 37.47,8.26 39.69,10.48 IC15.5
  Bottom 0.152: IC9.19 24.08,79.96 v23.18,79.06 | v38.42,77.47 40.12,77.47 41.58,76.01 41.58,75.12 37.44,70.98 37.44,62.3 26.78,51.63 26.78,21.03 v27.1,20.72 27.3,20.51 v27.3,8.73 | v32.07,20.64 v32.07,22.54
G8  (via drill 0.35)
  Top 0.152: IC22.19 65.14,93.72 v65.09,93.66 | v59.69,55.56 59.21,55.56 58.74,55.09 v58.74,50.16
  Bottom 0.152: v59.69,55.56 59.69,56.83 60.96,58.1 62.23,58.1 64.45,60.33 64.45,93.03 v65.09,93.66 | v58.74,50.16 58.42,49.85 IC41.4
G9  (via drill 0.35)
  Top 0.152: v60.96,55.56 60.64,55.24 IC31.8 | v65.97,83.5 66.03,83.56 IC23.19
  Bottom 0.152: v65.97,83.5 64.78,82.31 64.78,60.02 60.96,56.2 v60.96,55.56
G10  (via drill 0.35)
  Top 0.152: v62.23,55.88 61.91,56.2 59.05,56.2 57.78,56.2 56.83,55.24 IC31.11
  Bottom 0.152: v62.23,55.88 65.41,59.05 65.41,71.12 65.72,71.44 67.2,71.44 IC27.19
GND  (via drill 0.35)
  other vias: 11.11,52.7 28.26,55.24 30.48,53.34 28.26,71.75 33.02,71.75 19.21,83.98 26.67,84.14 26.35,86.36 18.1,86.04 41.27,90.81 43.81,86.68 44.13,81.6 40.64,81.6 46.67,75.88 42.86,73.66 50.48,79.38 60.33,77.47 59.69,66.67 86.68,64.77 88.9,76.68 84.77,83.82 70.8,93.66 85.88,57.47 82.55,43.81 64.14,52.7 64.77,46.67 56.83,51.75 47.62,50.8 49.21,48.58 46.35,48.58 46.35,45.09 41.27,36.2 30.8,30.48 53.82,32.54 67.31,31.43 87.63,26.04 72.07,27.62 64.14,27.62 60.01,27.62 56.52,20.64 57.47,22.23 48.9,24.45 47.31,17.14 25.72,11.43 24.45,7.78 44.45,7.94 30.8,17.14 6.35,1.91 19.84,17.3 20.8,34.61 27.94,45.09 41.43,53.98 45.09,59.37 42.23,58.1 60.96,57.15 65.72,57.47 84.14,26.04 30.48,64.45 23.18,50.16 19.37,46.04 19.37,43.81 60.33,87.63 61.28,95.89 65.09,95.89 69.22,47.94 71.44,53.02 71.44,46.35 69.22,52.07 65.72,51.12 69.53,45.4 70.8,73.66 71.12,63.5 73.98,83.5 28.89,66.04 82.23,38.26 73.98,41.59 69.53,40.01 50.8,59.37 49.53,59.37 58.9,32.38 58.74,39.85 19.21,61.44 10.79,61.44 12.54,66.2 14.76,66.2 17.78,73.03 14.76,75.72 12.7,75.72 12.22,82.55 21.75,17.3 22.38,11.43 15.88,11.43 30,15.24 43.18,18.73 56.99,10.16 56.99,13.02 61.12,18.26 35.24,31.11 49.53,39.85 67.47,28.42 74.14,16.83 81.12,12.86 84.3,13.49 51.75,51.91 45.72,64.93 47.94,64.93 25.72,60.96 30.32,80.64 92.23,35.4 97,37.94 60.33,51.28 16.83,52.55 11.11,51.12 11.75,48.9 14.29,48.9 16.99,49.37 87.95,20.48 87.95,19.53 87.95,18.57 93.34,15.88 93.34,16.99 94.3,16.99
  pour Bottom: -7.3,107.31 105.57,107.31 105.57,57.63 105.57,-6.83 21.11,-6.83 -7.3,-6.83
  pour Top: -10,109.22 107.16,109.22 107.16,38.73 107.16,-8.57 16.99,-8.57 -10,-8.57
H  (via drill 0.35)
  Top 0.152: IC37.19 85.3,39.79 v80.33,44.77 | v71.44,44.45 70.8,44.45 68.9,42.55 66.67,42.55 63.18,39.05 IC35.14
  Bottom 0.152: v80.33,44.77 79.96,44.4 IC36.19 72.92,44.45 v71.44,44.45
H0  (via drill 0.35)
  Top 0.152: v32.7,25.08 IC12.2 28.57,25.08 26.67,23.18 20.95,23.18 19.05,21.27 IC6.5 | v33.34,20 IC12.9
  Bottom 0.152: v32.7,25.08 32.7,20.64 v33.34,20
H1  (via drill 0.35)
  Top 0.152: v15.88,20 IC6.6
  Bottom 0.152: IC38.1 v15.88,20
H2  (via drill 0.35)
  Top 0.152: v33.97,24.45 34.61,25.08 IC12.13 | v33.97,21.91 21.27,21.91 18.1,18.73 IC6.7 v9.37,18.73 8.24,19.86 3.66,19.86 3.33,19.53 3.02,19.53 2.55,19.99 2.55,61.45 3.33,62.23 v3.49,62.23 | v9.37,9.76 9.84,9.76 9.9,9.83 25.21,9.83 27.11,7.92 37.77,7.92 39.69,9.84 45.09,9.84 45.72,10.48 IC15.10
  Bottom 0.152: v33.97,21.91 v33.97,24.45 | IC11.19 11.54,62.49 11.27,62.23 v3.49,62.23 | v9.37,18.73 v9.37,9.76
H3  (via drill 0.35)
  Top 0.152: v15.88,17.46 IC6.8
  Bottom 0.152: IC38.2 16.51,18.73 15.88,18.1 v15.88,17.46
HO0  (via drill 0.35)
  Top 0.152: IC31.9 59.37,49.85 58.74,49.21 58.74,46.35 58.42,46.04 54.29,46.04 | IC31.2 54.29,46.04 | 54.29,46.04 52.07,46.04 50.8,47.31 45.09,47.31 v42.55,44.77 | v42.55,33.66 IC30.5
  Bottom 0.152: v42.55,33.66 v42.55,44.77
HO1
  Top 0.152: IC39.1 65.41,40.32 64.45,39.37 64.45,38.42 63.18,37.15 46.35,37.15 43.81,34.61 IC30.6
HO2  (via drill 0.35)
  Top 0.152: IC31.13 54.29,50.8 53.66,50.16 v45.4,50.16 | v45.09,33.66 IC30.7 | IC29.19 72.12,56.25 70.48,54.61 69.85,53.98 69.85,51.75 69.85,51.44 68.9,50.48 65.41,50.48 60.66,45.73 51.63,45.73 50.69,46.67 v45.4,46.67
  Bottom 0.152: v45.4,50.16 v45.4,46.67 45.4,33.97 v45.09,33.66
HO3
  Top 0.152: IC39.2 65.41,39.05 65.09,38.73 65.09,38.1 62.87,35.88 48.26,35.88 46.35,33.97 IC30.8
INS_F3_0  (via drill 0.35)
  Top 0.152: IC6.21 v21.59,22.54 | v25.72,28.89 26.04,28.89 36.51,39.37 40.32,39.37 41.27,40.32 IC30.21 41.27,43.18 41.91,43.81 54.29,43.81 55.66,42.44 IC35.1
  Bottom 0.152: v25.72,28.89 24.56,28.89 22.86,27.19 22.86,23.81 v21.59,22.54 20.64,21.59 20.64,10.79 20.32,10.48 17.14,10.48 15.4,8.73 15.4,5.71 SIGNALS_C0.3
INS_F3_1  (via drill 0.35)
  Top 0.152: IC6.20 v22.23,21.27 | v25.08,28.26 26.04,28.26 26.67,28.89 26.67,29.1 28.31,30.74 36.63,39.05 41.27,39.05 41.43,39.21 42.55,40.32 IC30.20 42.55,43.18 42.86,43.5 53.02,43.5 53.98,42.55 53.98,40.64 54.29,40.32 IC35.2
  Bottom 0.152: v25.08,28.26 23.16,26.34 23.16,22.21 v22.23,21.27 20.95,20 20.95,10.64 17.94,7.62 17.94,5.71 SIGNALS_C0.5
INS_F3_2  (via drill 0.35)
  Top 0.152: IC35.3 45.09,39.05 43.81,37.78 35.88,37.78 29.94,31.84 v29.94,29.94 | v28.57,15.88 28.26,15.56 v21.59,15.56
  Bottom 0.152: v29.94,29.94 29.94,17.24 v28.57,15.88 | SIGNALS_C0.7 20.48,5.71 20.48,9.73 21.58,10.83 21.58,15.54 v21.59,15.56
LOAD_VRAM  (via drill 0.35)
  Top 0.152: v59.05,16.51 59.69,17.14 71.75,17.14 73.34,15.56 JP4.1 | v57.47,7.94 IC17.8
  Bottom 0.152: v59.05,16.51 59.05,9.53 v57.47,7.94
MB0
  Top 0.152: IC2.18 47.27,93.38 48.42,92.23 | IC1.21 49.69,90.96 48.42,92.23 | 48.42,92.23 51.75,95.57 MB_C0.1 56.52,96.84 58.42,96.84 60.01,95.25 60.01,94.3 60.64,93.66 61.6,93.66 IC22.2
MB1  (via drill 0.35)
  Top 0.152: IC1.22 49.19,90.51 46.97,92.73 v45.4,92.73 IC2.17 | MB_C0.2 58.1,95.57 60.64,93.03 61.62,93.03 IC22.3
  Bottom 0.152: MB_C0.2 56.52,94.3 46.97,94.3 v45.4,92.73
MB2  (via drill 0.35)
  Top 0.152: IC2.16 v46.04,92.08 46.66,92.08 48.69,90.06 IC1.23 | MB_C0.3 56.52,94.3 58.74,94.3 60.64,92.39 61.63,92.39 IC22.4
  Bottom 0.152: MB_C0.3 46.98,93.03 v46.04,92.08
MB3  (via drill 0.35)
  Top 0.152: IC1.25 47.69,90.1 46.35,91.44 v45.4,91.44 44.08,91.44 IC2.15 | MB_C0.4 59.05,93.03 60.33,91.76 61.65,91.76 IC22.5
  Bottom 0.152: MB_C0.4 56.52,91.76 47.31,91.76 46.99,91.44 v45.4,91.44
MB4  (via drill 0.35)
  Top 0.152: IC2.14 v46.04,90.78 46.06,90.78 47.19,89.65 IC1.26 | MB_C0.5 56.52,91.76 59.05,91.76 59.7,91.11 IC22.6
  Bottom 0.152: MB_C0.5 46.33,90.49 v46.04,90.78
MB5  (via drill 0.35)
  Top 0.152: IC1.27 46.69,89.2 45.72,90.17 v45.4,90.17 44.11,90.17 IC2.13 | MB_C0.6 61.63,90.49 IC22.7
  Bottom 0.152: MB_C0.6 56.52,89.22 46.67,89.22 45.72,90.17 v45.4,90.17
MB6  (via drill 0.35)
  Top 0.152: IC2.12 45.14,89.48 46.19,88.43 46.19,87.95 | 46.19,87.95 IC1.28 | v46.14,87.95 46.19,87.95 | MB_C0.7 55.88,87.95 57.15,89.22 59.37,89.22 60.01,89.85 61.62,89.85 IC22.8
  Bottom 0.152: MB_C0.7 v46.14,87.95
MB7  (via drill 0.35)
  Top 0.152: IC1.29 45.69,86.68 | 45.69,86.68 45.69,86.7 44.08,88.32 IC2.11 | v45.64,86.68 45.69,86.68 | MB_C0.8 59.05,87.95 60.33,89.22 61.6,89.22 IC22.9
  Bottom 0.152: MB_C0.8 56.52,86.68 v45.64,86.68
MB8  (via drill 0.35)
  Top 0.152: IC7.21 41.12,73.5 36.16,78.46 v30.48,78.46 IC3.18 | MB_C0.9 56.52,86.68 58.42,86.68 59.69,85.41 59.69,84.45 60.64,83.5 61.6,83.5 IC23.2
  Bottom 0.152: v30.48,78.46 32.98,80.96 IC8.18 32.98,83.47 34.92,85.41 MB_C0.9 55.88,85.41 57.15,86.68 58.85,86.68 59.43,86.09 IC26.9
MB9  (via drill 0.35)
  Top 0.152: IC3.17 31.11,77.81 | 31.11,77.81 36.17,77.81 40.64,73.34 40.64,69.19 IC7.22 | v31.07,77.77 | v31.07,77.77 31.11,77.81 | MB_C0.10 58.1,85.41 60.64,82.87 61.62,82.87 IC23.3
  Bottom 0.152: v31.07,77.77 33.63,80.33 IC8.17 33.63,83.32 35.4,85.09 53.68,85.09 54.63,84.14 56.52,84.14 MB_C0.10 57.82,85.44 IC26.8
MB10  (via drill 0.35)
  Top 0.152: IC3.16 31.43,77.16 | 31.43,77.16 36.19,77.16 40.12,73.23 IC7.23 | v31.71,77.12 31.48,77.12 31.43,77.16 | MB_C0.11 56.52,84.14 58.74,84.14 60.64,82.23 61.63,82.23 IC23.4
  Bottom 0.152: v31.71,77.12 34.28,79.69 IC8.16 34.28,83.18 35.88,84.77 53.25,84.77 55.16,82.87 MB_C0.11 55.88,82.87 57.15,84.14 58.74,84.14 59.4,84.8 IC26.7
MB11  (via drill 0.35)
  Top 0.152: IC3.15 v32.38,76.51 | v32.38,76.51 36.2,76.51 39.12,73.59 IC7.25 | v32.38,76.51 | MB_C0.12 58.42,82.87 59.69,81.6 61.65,81.6 IC23.5
  Bottom 0.152: v32.38,76.51 34.93,79.06 IC8.15 34.93,83.19 36.2,84.45 51.87,84.45 54.51,81.81 56.73,81.81 MB_C0.12 58.74,82.87 60.02,84.14 IC26.6
MB12  (via drill 0.35)
  Top 0.152: IC3.14 v33.02,75.86 | v33.02,75.86 35.9,75.86 38.62,73.14 IC7.26 | v33.02,75.86 | MB_C0.13 55.88,80.33 57.15,81.6 58.74,81.6 59.38,80.95 IC23.6
  Bottom 0.152: v33.02,75.86 35.58,78.42 IC8.14 35.58,83.21 36.51,84.14 51.44,84.14 MB_C0.13 55.88,80.33 57.15,81.6 58.42,81.6 60.33,83.5 61.65,83.5 IC26.5
MB13  (via drill 0.35)
  Top 0.152: IC3.13 v33.66,75.21 | v33.66,75.21 35.6,75.21 38.12,72.69 IC7.27 | v33.66,75.21 | MB_C0.14 61.63,80.33 IC23.7
  Bottom 0.152: v33.66,75.21 36.23,77.79 IC8.13 36.23,83.22 36.83,83.82 49.96,83.82 54.72,79.06 56.52,79.06 MB_C0.14 60.33,82.87 61.63,82.87 IC26.4
MB14  (via drill 0.35)
  Top 0.152: IC3.12 v34.29,74.56 | v34.29,74.56 35.61,74.56 37.62,72.55 IC7.28 | v34.29,74.56 | MB_C0.15 56.52,79.06 59.69,79.06 60.33,79.69 61.62,79.69 IC23.8
  Bottom 0.152: v34.29,74.56 36.88,77.15 IC8.12 36.88,83.24 37.15,83.5 49.53,83.5 MB_C0.15 55.88,77.79 57.15,79.06 58.42,79.06 59.37,80.01 59.37,81.28 60.29,82.19 IC26.3
MB15  (via drill 0.35)
  Top 0.152: IC3.11 34.61,73.91 | 34.61,73.91 35.63,73.91 37.15,72.39 37.15,69.2 IC7.29 | v34.77,73.75 34.61,73.91 | MB_C0.16 59.05,77.79 60.33,79.06 61.6,79.06 IC23.9
  Bottom 0.152: v34.77,73.75 37.53,76.52 IC8.11 48.84,82.29 54.61,76.52 56.52,76.52 MB_C0.16 60.01,80.01 60.01,80.96 60.59,81.55 IC26.2
MB16  (via drill 0.35)
  Top 0.152: IC4.18 21.75,68.14 v21.91,68.3 25.72,68.3 28.86,68.3 32.55,64.61 IC20.21 32.55,59.53 32.7,59.37 35.36,59.37 51.23,75.25 MB_C0.17 56.2,76.2 56.52,76.52 58.42,76.52 59.69,75.25 59.69,73.98 60.27,73.39 IC24.2
  Bottom 0.152: IC9.18 24.73,79.34 21.91,76.52 v21.91,68.3 | MB_C0.17 55.88,75.25 57.15,76.52 59.69,76.52 60.33,75.88 61.6,75.88 IC27.9
MB17  (via drill 0.35)
  Top 0.152: IC4.17 22.38,67.49 v22.54,67.65 28.98,67.65 32.05,64.59 IC20.22 32.05,59.6 32.58,59.07 35.48,59.07 50.39,73.98 56.52,73.98 MB_C0.18 60.29,72.75 IC24.3
  Bottom 0.152: IC9.17 25.38,79.03 22.54,76.2 v22.54,67.65 | MB_C0.18 61.62,75.25 IC27.8
MB18  (via drill 0.35)
  Top 0.152: IC4.16 23.02,66.84 v23.18,67 28.89,67 31.55,64.34 IC20.23 31.55,59.66 32.45,58.76 35.61,58.76 49.55,72.71 MB_C0.19 56.2,72.71 57.47,73.98 58.42,73.98 60.33,72.07 61.63,72.07 IC24.4
  Bottom 0.152: IC9.16 26.03,78.73 23.18,75.88 v23.18,67 | MB_C0.19 56.52,73.98 58.74,73.98 59.4,74.64 IC27.7
MB19  (via drill 0.35)
  Top 0.152: IC4.15 23.65,66.19 v23.81,66.35 27.66,66.35 30.55,63.46 IC20.25 30.55,59.62 31.71,58.46 35.73,58.46 48.71,71.44 56.52,71.44 MB_C0.20 58.74,72.71 60.01,71.44 61.65,71.44 IC24.5
  Bottom 0.152: IC9.15 26.68,78.43 23.81,75.56 v23.81,66.35 | MB_C0.20 58.74,72.71 60.02,73.98 IC27.6
MB20  (via drill 0.35)
  Top 0.152: v24.45,65.7 24.29,65.54 IC4.14 | v24.45,65.7 27.64,65.7 30.05,63.3 IC20.26 30.05,59.69 31.59,58.15 35.86,58.15 47.88,70.17 MB_C0.21 56.2,70.17 57.47,71.44 59.05,71.44 59.7,70.8 IC24.6 | v24.45,65.7
  Bottom 0.152: IC9.14 27.33,78.13 24.45,75.25 v24.45,65.7 | MB_C0.21 56.52,71.44 58.42,71.44 60.33,73.34 61.65,73.34 IC27.5
MB21  (via drill 0.35)
  Top 0.152: IC4.13 24.93,64.89 v25.08,65.05 27.66,65.05 29.55,63.16 IC20.27 29.55,59.67 31.37,57.85 35.99,57.85 47.04,68.9 56.52,68.9 MB_C0.22 61.63,70.17 IC24.7
  Bottom 0.152: IC9.13 27.98,77.83 25.08,74.93 v25.08,65.05 | MB_C0.22 60.3,72.69 IC27.4
MB22  (via drill 0.35)
  Top 0.152: IC4.12 25.56,64.24 v25.72,64.4 27.68,64.4 29.05,63.03 IC20.28 29.05,59.74 31.32,57.47 36.04,57.47 46.2,67.63 MB_C0.23 56.2,67.63 57.47,68.9 59.69,68.9 60.33,69.53 61.62,69.53 IC24.8
  Bottom 0.152: IC9.12 28.63,77.52 25.72,74.61 v25.72,64.4 | MB_C0.23 56.52,68.9 58.42,68.9 59.05,69.53 59.05,70.48 60.6,72.03 IC27.3
MB23  (via drill 0.35)
  Top 0.152: IC24.9 61.6,68.9 60.64,68.9 59.37,67.63 MB_C0.24 56.52,66.36 45.36,66.36 36.16,57.16 31.19,57.16 28.55,59.81 IC20.29 28.55,62.83 27.62,63.75 v26.35,63.75 26.2,63.59 IC4.11
  Bottom 0.152: IC9.11 29.28,77.22 26.35,74.3 v26.35,63.75 | MB_C0.24 59.69,69.53 59.69,70.48 60.59,71.39 IC27.2
MB24  (via drill 0.35)
  Top 0.152: IC29.2 65.99,56.25 65.09,57.15 65.09,60.96 62.81,63.23 IC25.2 61.6,63.18 60.64,63.18 59.37,64.45 59.37,65.41 58.42,66.36 57.15,66.36 56.52,65.72 55.88,65.72 MB_C0.25 52.39,62.23 42.23,62.23 30.8,50.8 24.45,50.8 23.98,51.27 IC21.21 23.98,56.99 22.82,58.14 v20,58.14 IC5.18
  Bottom 0.152: MB_C0.25 56.52,66.36 58.74,66.36 59.37,65.72 61.6,65.72 IC28.9 | IC10.18 16.47,80.64 19.14,77.97 19.14,66.74 22.31,63.57 22.31,58.51 21.95,58.14 v20,58.14 17.74,58.14 16.74,59.15 IC11.11
MB25  (via drill 0.35)
  Top 0.152: IC29.3 66.21,55.6 64.72,57.09 64.72,60.69 62.83,62.59 IC25.3 61.62,62.55 60.33,62.55 MB_C0.26 56.52,63.82 54.61,63.82 52.7,61.91 42.34,61.91 30.92,50.49 24.32,50.49 23.58,51.23 23.58,51.92 IC21.22 23.5,52.05 23.5,56.36 22.36,57.49 v19.37,57.49 IC5.17
  Bottom 0.152: MB_C0.26 57.82,65.12 IC28.8 | IC10.17 17.12,80.42 19.44,78.1 19.44,66.87 22.62,63.7 22.62,57.7 22.38,57.47 19.39,57.47 v19.37,57.49 17.6,57.49 16.09,59 IC11.12
MB26  (via drill 0.35)
  Top 0.152: IC29.4 66.42,54.95 64.41,56.96 64.41,60.36 62.84,61.94 IC25.4 60.3,61.94 58.42,63.82 57.15,63.82 55.88,62.55 MB_C0.27 54.29,61.59 42.55,61.59 31.14,50.19 24.2,50.19 23.08,51.3 23.08,51.92 IC21.23 23.02,52.07 23.02,55.56 21.74,56.84 v20,56.84 IC5.16
  Bottom 0.152: MB_C0.27 56.52,63.82 59.05,63.82 59.71,64.47 IC28.7 | IC10.16 17.77,80.2 19.75,78.22 19.75,67 22.92,63.82 22.92,57.58 22.19,56.84 v20,56.84 17.45,56.84 15.44,58.86 IC11.13
MB27  (via drill 0.35)
  Top 0.152: IC29.5 66.36,54.29 64.11,56.54 64.11,59.72 62.54,61.28 IC25.5 61.65,61.28 60.01,61.28 58.74,62.55 MB_C0.28 56.52,61.28 42.66,61.28 30.95,49.57 22.5,49.57 21.98,50.1 IC21.25 21.98,55.34 21.12,56.19 v19.37,56.19 IC5.15
  Bottom 0.152: MB_C0.28 58.74,62.55 60.02,63.83 IC28.6 | IC10.15 18.42,79.98 20.05,78.35 20.05,67.12 23.23,63.95 23.23,57.45 21.97,56.19 v19.37,56.19 17.31,56.19 14.79,58.72 IC11.14
MB28  (via drill 0.35)
  Top 0.152: IC29.6 66.36,53.65 63.8,56.21 63.8,59.38 62.55,60.63 IC25.6 59.7,60.63 59.05,61.28 57.47,61.28 56.2,60.01 MB_C0.29 54.29,60.96 42.77,60.96 31.07,49.26 22.06,49.26 21.48,49.85 IC21.26 21.48,54.73 20.66,55.54 v20,55.54 IC5.14
  Bottom 0.152: MB_C0.29 56.52,61.28 58.42,61.28 60.32,63.17 IC28.5 | IC10.14 19.07,79.76 20.36,78.47 20.36,67.25 23.53,64.07 23.53,57.33 21.75,55.54 v20,55.54 17.17,55.54 14.14,58.57 IC11.15
MB29  (via drill 0.35)
  Top 0.152: IC29.7 66.38,53 63.5,55.88 63.5,59.05 62.57,59.98 IC25.7 61.63,60.01 MB_C0.30 56.52,58.74 54.61,58.74 52.7,60.64 42.89,60.64 31.2,48.96 21.84,48.96 20.98,49.83 IC21.27 20.98,54.27 20.36,54.89 v19.37,54.89 IC5.13
  Bottom 0.152: MB_C0.30 60.3,62.52 IC28.4 | IC10.13 19.72,79.54 20.66,78.6 20.66,67.38 23.84,64.2 23.84,57.2 21.53,54.89 v19.37,54.89 17.02,54.89 13.49,58.43 IC11.16
MB30  (via drill 0.35)
  Top 0.152: IC29.8 66.39,52.35 63.18,55.56 63.18,58.74 62.59,59.34 IC25.8 61.62,59.37 60.33,59.37 59.69,58.74 57.15,58.74 55.88,57.47 MB_C0.31 52.38,60.34 43.01,60.34 31.33,48.65 21.72,48.65 20.58,49.79 20.58,51.92 IC21.28 20.48,53.82 v20.05,54.24 IC5.12
  Bottom 0.152: MB_C0.31 56.52,58.74 58.42,58.74 59.05,59.37 59.05,60.33 60.6,61.88 IC28.3 | IC10.12 20.37,79.32 20.97,78.73 20.97,67.5 24.14,64.33 24.14,57.07 21.31,54.24 v20.05,54.24 16.88,54.24 12.84,58.28 IC11.17
MB31  (via drill 0.35)
  Top 0.152: IC29.9 66.41,51.7 62.87,55.24 62.87,58.42 62.6,58.69 IC25.9 61.6,58.74 60.33,58.74 59.05,57.47 MB_C0.32 56.52,56.2 54.61,56.2 53.98,56.83 53.98,58.1 52.05,60.03 43.14,60.03 31.45,48.35 21.59,48.35 20.08,49.86 20.08,51.92 IC21.29 20,52.05 20,53.34 19.75,53.59 v17.94,53.59 IC5.11
  Bottom 0.152: MB_C0.32 59.69,59.37 59.69,60.33 60.59,61.23 IC28.2 | IC10.11 21.02,79.11 21.27,78.86 21.27,67.63 24.45,64.45 24.45,56.95 21.09,53.59 v17.94,53.59 16.74,53.59 12.19,58.14 IC11.18
MEM_LOAD  (via drill 0.35)
  Top 0.152: v57.15,35.24 IC35.6 | IC14.13 35.91,13.34 v34.05,13.34 | IC17.9 57.64,9.21 v55.73,7.3 55.71,7.3 55.09,6.68 34.53,6.68 v34.46,6.75 34.07,6.35 32.7,6.35 32.05,7 28.1,7 26.75,7 24.83,8.91 16.92,8.91 v16.67,8.66 | v68.9,23.81 69.85,23.81 IC18.12 73.34,23.81 73.98,24.45 v80.01,24.45 | v68.9,29.21 v55.73,29.21 | v68.9,33.34 JP4.8
  Bottom 0.152: v55.73,7.3 v55.73,29.21 55.73,33.83 v57.15,35.24 | v34.05,13.34 34.05,7.16 v34.46,6.75 | v68.9,23.81 v68.9,29.21 v68.9,33.34 66.52,35.72 IC40.2 | R3.1 80.33,24.13 v80.01,24.45 | v16.67,8.66 SIGNALS_C0.6
MEM_STORE  (via drill 0.35)
  Top 0.152: IC17.1 v54.93,15.56 55.56,14.92 60.96,14.92 61.59,15.56 IC19.1 65.72,15.56 v66.36,14.92 v72.39,14.92 | IC14.11 v33.49,12.06 | v72.71,28.26 73.34,28.26 75.88,30.8 JP4.7 | v14.13,8.97 14.38,9.22 21.11,9.22 24.96,9.22 26.87,7.3 32.62,7.3 32.86,7.06 v33.34,7.06 33.89,7.06 34.14,7.32 54.91,7.32 v54.93,7.3
  Bottom 0.152: v54.93,7.3 v54.93,15.56 | v33.49,12.06 33.49,7.22 v33.34,7.06 | R1.1 67.31,13.97 v66.36,14.92 | v72.39,14.92 72.39,17.14 72.71,17.46 v72.71,28.26 | SIGNALS_C0.4 v14.13,8.97
N$1
  Top 0.152: IC12.3 IC12.4
N$2  (via drill 0.35)
  Top 0.152: IC15.9 v45.4,9.21 | v45.4,22.54 IC13.11
  Bottom 0.152: v45.4,9.21 v45.4,22.54
N$3  (via drill 0.35)
  Top 0.152: IC17.5 v51.67,10.48 | v51.67,13.02 IC17.3
  Bottom 0.152: v51.67,10.48 v51.67,13.02
N$4  (via drill 0.35)
  Top 0.152: IC18.10 IC18.5 v62.55,21.27 | IC18.2 v62.55,25.08 IC16.13 | v62.55,9.21 IC19.6
  Bottom 0.152: v62.55,25.08 v62.55,21.27 v62.55,9.21
N$5
  Top 0.152: IC19.5 65.72,10.48 66.04,10.79 66.04,12.7 65.72,13.02 IC19.3
N$6
  Top 0.152: IC31.4 IC31.3
N$7  (via drill 0.35)
  Top 0.152: IC16.10 IC16.5 v50.48,21.27 | IC16.2 v50.48,25.08 | v50.48,14.29 IC15.13 | v50.48,9.21 IC17.6
  Bottom 0.152: v50.48,25.08 v50.48,21.27 v50.48,14.29 v50.48,9.21
N$8
  Bottom 0.152: R1.2 67.63,9.53 T1.B
N$9
  Bottom 0.152: T2.B 77.79,13.97 78.42,14.61 80.33,16.51 R3.2
N$10  (via drill 0.35)
  Top 0.152: LED1.C 72.61,6.13 72.39,6.35 v72.39,6.99
  Bottom 0.152: v72.39,6.99 72.39,7.94 72.71,8.26 R2.2
N$11
  Bottom 0.152: R2.1 73.34,10.48 T1.C
N$12  (via drill 0.35)
  Top 0.152: v75.25,6.99 75.25,6.35 75.56,6.03 76.42,6.03 LED8.C
  Bottom 0.152: R4.2 75.57,8.26 75.25,7.94 v75.25,6.99
N$13
  Bottom 0.152: R4.1 76.52,10.48 77.15,10.48 77.64,10.96 T2.C
N$14
  Bottom 0.152: R5.2 83.19,18.1 81.92,16.83 T3.B
N$15  (via drill 0.35)
  Top 0.152: LED2.C 79.91,6.13 79.69,6.35 v79.69,6.99
  Bottom 0.152: v79.69,6.99 79.69,7.94 80.01,8.26 R6.2
N$16
  Bottom 0.152: R6.1 82.87,12.06 T3.C
N$17
  Bottom 0.152: T4.B R7.2
N$18  (via drill 0.35)
  Top 0.152: v82.87,6.99 82.87,6.35 83.19,6.03 84.04,6.03 LED3.C
  Bottom 0.152: R8.2 83.19,8.26 82.87,7.94 v82.87,6.99
N$19
  Bottom 0.152: T4.C 85.9,13.51 84.14,11.74 R8.1
N$20
  Bottom 0.152: T5.B R9.2
N$21  (via drill 0.35)
  Top 0.152: LED4.C 86.26,6.13 86.04,6.35 v86.04,6.99
  Bottom 0.152: v86.04,6.99 86.04,7.94 86.36,8.26 R10.2
N$22
  Bottom 0.152: T5.C 89.39,13.51 87.31,11.43 R10.1
N$23  (via drill 0.35)
  Top 0.152: v65.56,43.97 62.07,43.97 61.44,43.34 v60.33,43.34
  Bottom 0.152: IC40.4 v65.57,43.97 v65.56,43.97 | IC41.1 v60.33,43.34
RAM_O_0  (via drill 0.35)
  Top 0.152: IC22.18 69.32,93.06 69.69,92.69 v69.69,92.59 v74.77,92.59 v79.85,92.59 91.65,92.59 93.03,93.97 RAM_O_C0.1
  Bottom 0.152: IC26.11 68.33,86.75 69.69,88.11 v69.69,92.59 | IC27.11 68.33,76.58 74.77,83.03 v74.77,92.59 | IC28.11 68.33,66.42 79.85,77.95 v79.85,92.59
RAM_O_1  (via drill 0.35)
  Top 0.152: RAM_O_C0.2 94.31,92.72 94.31,92.71 92.39,92.71 91.62,91.94 v80.49,91.94 v75.41,91.94 v70.33,91.94 69.35,91.94 68.88,92.42 IC22.17
  Bottom 0.152: IC26.12 68.63,86.09 70.33,87.79 v70.33,91.94 | IC27.12 68.31,75.94 75.41,83.03 v75.41,91.94 | IC28.12 68.31,65.78 80.49,77.95 v80.49,91.94
RAM_O_2  (via drill 0.35)
  Top 0.152: RAM_O_C0.3 92.87,91.29 v81.12,91.29 v76.04,91.29 v70.96,91.29 69.53,91.29 69.05,91.77 IC22.16
  Bottom 0.152: IC26.13 68.94,85.44 70.96,87.47 v70.96,91.29 | IC27.13 68.3,75.28 76.04,83.03 v76.04,91.29 | IC28.13 68.3,65.12 81.12,77.95 v81.12,91.29
RAM_O_3  (via drill 0.35)
  Top 0.152: RAM_O_C0.4 95.57,91.43 94.31,90.17 92.39,90.17 91.92,90.64 v81.76,90.64 v76.68,90.64 71.75,90.64 v71.6,90.64 69.54,90.64 69.06,91.11 IC22.15
  Bottom 0.152: IC26.14 69.08,84.8 71.6,87.31 v71.6,90.64 | IC27.14 68.28,74.64 76.68,83.03 v76.68,90.64 | IC28.14 68.28,64.47 81.76,77.95 v81.76,90.64
RAM_O_4  (via drill 0.35)
  Top 0.152: RAM_O_C0.5 91.94,89.99 v82.39,89.99 v77.31,89.99 v72.23,89.99 69.71,89.99 69.22,90.49 67.28,90.49 IC22.14
  Bottom 0.152: IC26.15 69.38,84.14 72.23,87 v72.23,89.99 | IC27.15 68.27,73.98 77.31,83.03 v77.31,89.99 | IC28.15 68.27,63.83 82.39,77.95 v82.39,89.99
RAM_O_5  (via drill 0.35)
  Top 0.152: v72.87,89.34 73.03,89.34 | 73.03,89.34 v77.95,89.34 v83.03,89.34 90.65,89.34 92.36,87.63 94.31,87.63 95.57,88.89 RAM_O_C0.6 | IC22.13 69.09,89.81 69.57,89.34 73.03,89.34
  Bottom 0.152: IC26.16 69.84,83.5 72.87,86.52 v72.87,89.34 | IC27.16 68.25,73.33 77.95,83.03 v77.95,89.34 | IC28.16 68.25,63.17 83.03,77.95 v83.03,89.34
RAM_O_6  (via drill 0.35)
  Top 0.152: RAM_O_C0.7 90.7,88.69 v83.66,88.69 v78.58,88.69 v73.5,88.69 69.58,88.69 69.11,89.17 IC22.12
  Bottom 0.152: IC26.17 70.3,82.84 73.5,86.04 v73.5,88.69 | IC27.17 68.24,72.69 78.58,83.03 v78.58,88.69 | IC28.17 68.24,62.52 83.66,77.95 v83.66,88.69
RAM_O_7  (via drill 0.35)
  Top 0.152: v65.41,48.9 65.46,48.95 IC33.2 IC33.3 IC33.4 IC33.5 IC33.6 IC33.7 IC33.8 IC33.9 | v97.71,43.9 98.11,44.3 98.11,83.82 RAM_O_C0.8 94.3,85.09 92.48,85.09 89.53,88.04 v84.3,88.04 v79.22,88.04 v74.14,88.04 69.44,88.04 68.97,88.52 IC22.11 | v71.12,56.2 70.48,55.56 v69.22,55.56
  Bottom 0.152: IC26.18 71.72,82.19 74.14,84.61 v74.14,88.04 | IC27.18 68.22,72.03 79.22,83.03 v79.22,88.04 | v84.3,88.04 83.98,87.72 83.98,77.63 69.25,62.9 69.25,61.88 | IC32.2 67.69,51.75 | 67.69,51.75 IC32.3 IC32.4 IC32.5 IC32.6 IC32.7 IC32.8 | IC32.8 IC32.9 | IC34.9 IC34.8 IC34.7 IC34.6 IC34.5 IC34.4 IC34.3 IC34.2 97.26,45.61 97.71,45.17 v97.71,43.9 | v69.22,55.56 67.72,55.56 IC32.8 | v65.41,48.9 64.77,49.53 64.77,51.44 65.09,51.75 67.69,51.75 | IC28.18 69.25,61.88 | 69.25,61.88 71.12,60.01 v71.12,56.2
RAM_O_8  (via drill 0.35)
  Top 0.152: IC23.18 v84.77,82.91 92.12,82.91 92.12,82.92 RAM_O_C0.9 | IC29.18 74.02,55.6 74.93,56.52 v74.93,57.15
  Bottom 0.152: v84.77,82.91 84.77,77.79 74.93,67.94 v74.93,57.15 74.68,56.9 IC32.11
RAM_O_9  (via drill 0.35)
  Top 0.152: IC23.17 v85.41,82.25 92.1,82.25 92.39,82.55 94.31,82.55 94.31,82.56 RAM_O_C0.10 | IC29.17 74.32,54.95 75.74,56.37 v75.74,57.15
  Bottom 0.152: v85.41,82.25 85.41,77.15 75.74,67.48 v75.74,57.15 75.74,56.52 75.47,56.25 IC32.12
RAM_O_10  (via drill 0.35)
  Top 0.152: IC23.16 v86.04,81.61 92.69,81.61 93.02,81.28 RAM_O_C0.11 | IC29.16 74.62,54.3 76.54,56.22 v76.54,57.15
  Bottom 0.152: v86.04,81.61 86.04,77.36 76.52,67.83 76.52,57.15 v76.54,57.15 76.54,56.52 75.63,55.6 IC32.13
RAM_O_11  (via drill 0.35)
  Top 0.152: IC23.15 v86.68,80.95 91.45,80.95 92.39,80.01 94.31,80.01 94.31,80.02 RAM_O_C0.12 | IC29.15 74.61,53.65 77.35,56.4 v77.35,57.15
  Bottom 0.152: v86.68,80.95 86.68,77.56 77.35,68.23 v77.35,57.15 77.35,56.52 75.79,54.95 IC32.14
RAM_O_12  (via drill 0.35)
  Top 0.152: IC23.14 v87.31,80.31 91.45,80.31 93.02,78.74 RAM_O_C0.13 | IC29.14 74.59,53 74.93,53.34 78.16,56.57 v78.16,57.15
  Bottom 0.152: v87.31,80.31 87.31,77.76 78.16,68.61 v78.16,57.15 78.16,56.52 75.94,54.3 IC32.15
RAM_O_13  (via drill 0.35)
  Top 0.152: IC23.13 v87.95,79.66 91,79.66 91.76,78.9 91.76,78.11 92.39,77.47 94.31,77.47 95.57,78.73 RAM_O_C0.14 | IC29.13 74.58,52.35 78.97,56.74 v78.97,57.15
  Bottom 0.152: v87.95,79.66 87.95,77.97 78.97,68.99 v78.97,57.15 78.97,56.52 76.1,53.65 IC32.16
RAM_O_14  (via drill 0.35)
  Top 0.152: IC23.12 88.32,79 88.42,78.9 v88.5,78.9 90.33,78.9 RAM_O_C0.15 | IC29.12 74.56,51.7 79.77,56.91 v79.77,57.15
  Bottom 0.152: v88.5,78.9 88.5,78.09 79.77,69.36 v79.77,57.15 79.77,56.52 76.26,53 IC32.17
RAM_O_15  (via drill 0.35)
  Top 0.152: IC23.11 88.17,78.36 v88.94,77.59 89.74,77.59 92.39,74.93 94.31,74.93 94.31,74.94 RAM_O_C0.16 95.57,76.19 97.79,73.97 97.79,44.77 97.37,44.34 IC37.9 IC37.8 IC37.7 IC37.6 IC37.5 IC37.4 IC37.3 IC37.2 | v80.64,57.15 74.55,51.05 IC29.11 72.9,51.12 71.75,51.12 70.8,50.16 66.36,50.16 v66.04,49.85
  Bottom 0.152: v88.94,77.59 88.43,77.59 80.64,69.8 v80.64,57.15 80.64,56.52 76.48,52.35 IC32.18 | IC36.2 IC36.3 IC36.4 IC36.5 IC36.6 IC36.7 IC36.8 IC36.9 66.31,48.95 66.04,49.21 v66.04,49.85
RAM_O_16  (via drill 0.35)
  Top 0.152: IC24.18 v85.72,72.75 92.12,72.75 93.03,73.65 RAM_O_C0.17 | v79.69,45.4 78.04,43.75 IC33.11
  Bottom 0.152: IC36.18 79.34,45.05 v79.69,45.4 85.09,50.8 85.09,67.35 85.72,67.98 v85.72,72.75
RAM_O_17  (via drill 0.35)
  Top 0.152: IC24.17 v85.09,72.09 92.1,72.09 92.39,72.39 94.31,72.39 95.57,73.65 RAM_O_C0.18 | v79.06,46.04 77.42,44.4 IC33.12
  Bottom 0.152: IC36.17 78.72,45.7 v79.06,46.04 84.45,51.44 84.45,67.33 85.09,67.97 v85.09,72.09
RAM_O_18  (via drill 0.35)
  Top 0.152: IC24.16 v84.45,71.44 91.59,71.44 91.93,71.11 93.02,71.11 RAM_O_C0.19 | v78.42,46.67 76.8,45.05 IC33.13
  Bottom 0.152: IC36.16 78.1,46.35 v78.42,46.67 83.82,52.07 83.82,67.32 84.45,67.95 v84.45,71.44
RAM_O_19  (via drill 0.35)
  Top 0.152: IC24.15 v83.82,70.8 91.45,70.8 92.39,69.85 94.31,69.85 94.31,69.86 RAM_O_C0.20 | v77.79,47.31 76.18,45.7 IC33.14
  Bottom 0.152: IC36.15 77.48,47 77.63,47.15 | 77.63,47.15 v77.79,47.31 | v83.82,70.8 83.82,67.94 83.19,67.3 83.19,52.7 v77.79,47.31 | 77.63,47.15 v77.79,47.31
RAM_O_20  (via drill 0.35)
  Top 0.152: IC24.14 v83.19,70.14 91.46,70.14 RAM_O_C0.21 | v77.15,47.94 75.56,46.35 IC33.15